# Altium schematic sheet Config-Flash.SchDoc
size A3; SheetNumber: 3; SheetTotal: 7
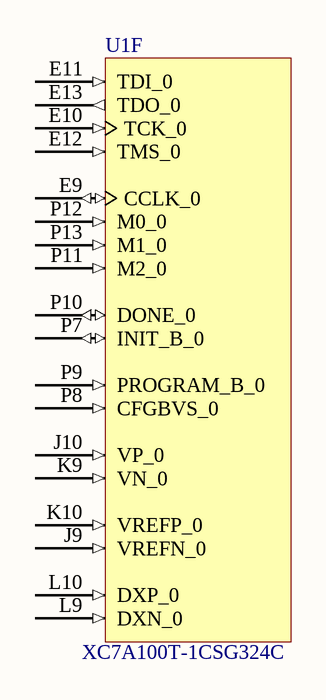
[diagram p0: Config-Flash.SchDoc]

## Parts
U1  XC7A100T-1CSG324C  [CSG324]  (part F of 9)

## Nets

Not connected (* = marked no-connect by the designer): U1 E9(CCLK_0) E10(TCK_0) E11(TDI_0) E12(TMS_0) E13(TDO_0) J9(VREFN_0) J10(VP_0) K9(VN_0) K10(VREFP_0) L9(DXN_0) L10(DXP_0) P7(INIT_B_0) P8(CFGBVS_0) P9(PROGRAM_B_0) P10(DONE_0) P11(M2_0) P12(M0_0) P13(M1_0)

## Library data of the parts
U1 = CMP-016-00010-1: Field Programmable Gate Array, 7925 CLBs, 1098MHz, 101440-Cell, PBGA324; Nominal Supply Voltage: 1V; Package Body Material: Plastic; Min Supply Voltage: 950mV; Max Supply Voltage: 1.05V; Number of Outputs: 210; Number of Logic Elements/Cells: 101440; Clock Frequency: 1.098GHz; Qualification Status: Not Qualified; Number of CLBs: 7925; Combinatorial Delay of a CLB-Max: 1.27ns; Terminal Finish: Copper; Moisture Sensitivity Level: 3; Terminal Position: BOTTOM; Max Operating Temperature: 85°C; Pins: 324; Case/Package: LFBGA; Number of Inputs: 210; Power Supplies: 1V; Height - Seated (Max): 1.5mm; Surface Mount: Yes; Package Style: GRID ARRAY, LOW PROFILE, FINE PITCHMeter; JESD-609 Code: e1; Reach SVHC Compliant: Yes; Programmable Logic Type: FIELD PROGRAMMABLE GATE ARRAY; Terminal Pitch: 0.8mm; Package Shape: Square; Width: 15mm; Terminal Form: Ball; Length: 15mm; RoHS Compliant: Yes; Temperature Grade: OTHER; Technology: CMOS; Min Operating Temperature: 0°C